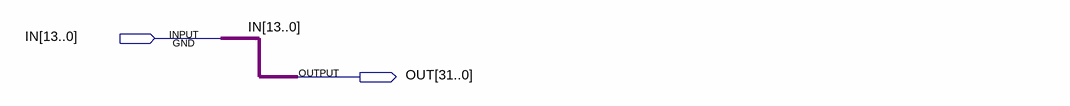
[diagram p0: schematic sheet]
// Quartus schematic signext14_32.bdf as structural Verilog: 0 symbols, 2 pins
module signext14_32 (
  input  [13:0] IN,
  output [31:0] OUT
);


  assign OUT = {{19{IN[13]}}, IN[12:0]};
endmodule
